# EAGLE design STM32F405RGT6  (EAGLE 9.6.2)
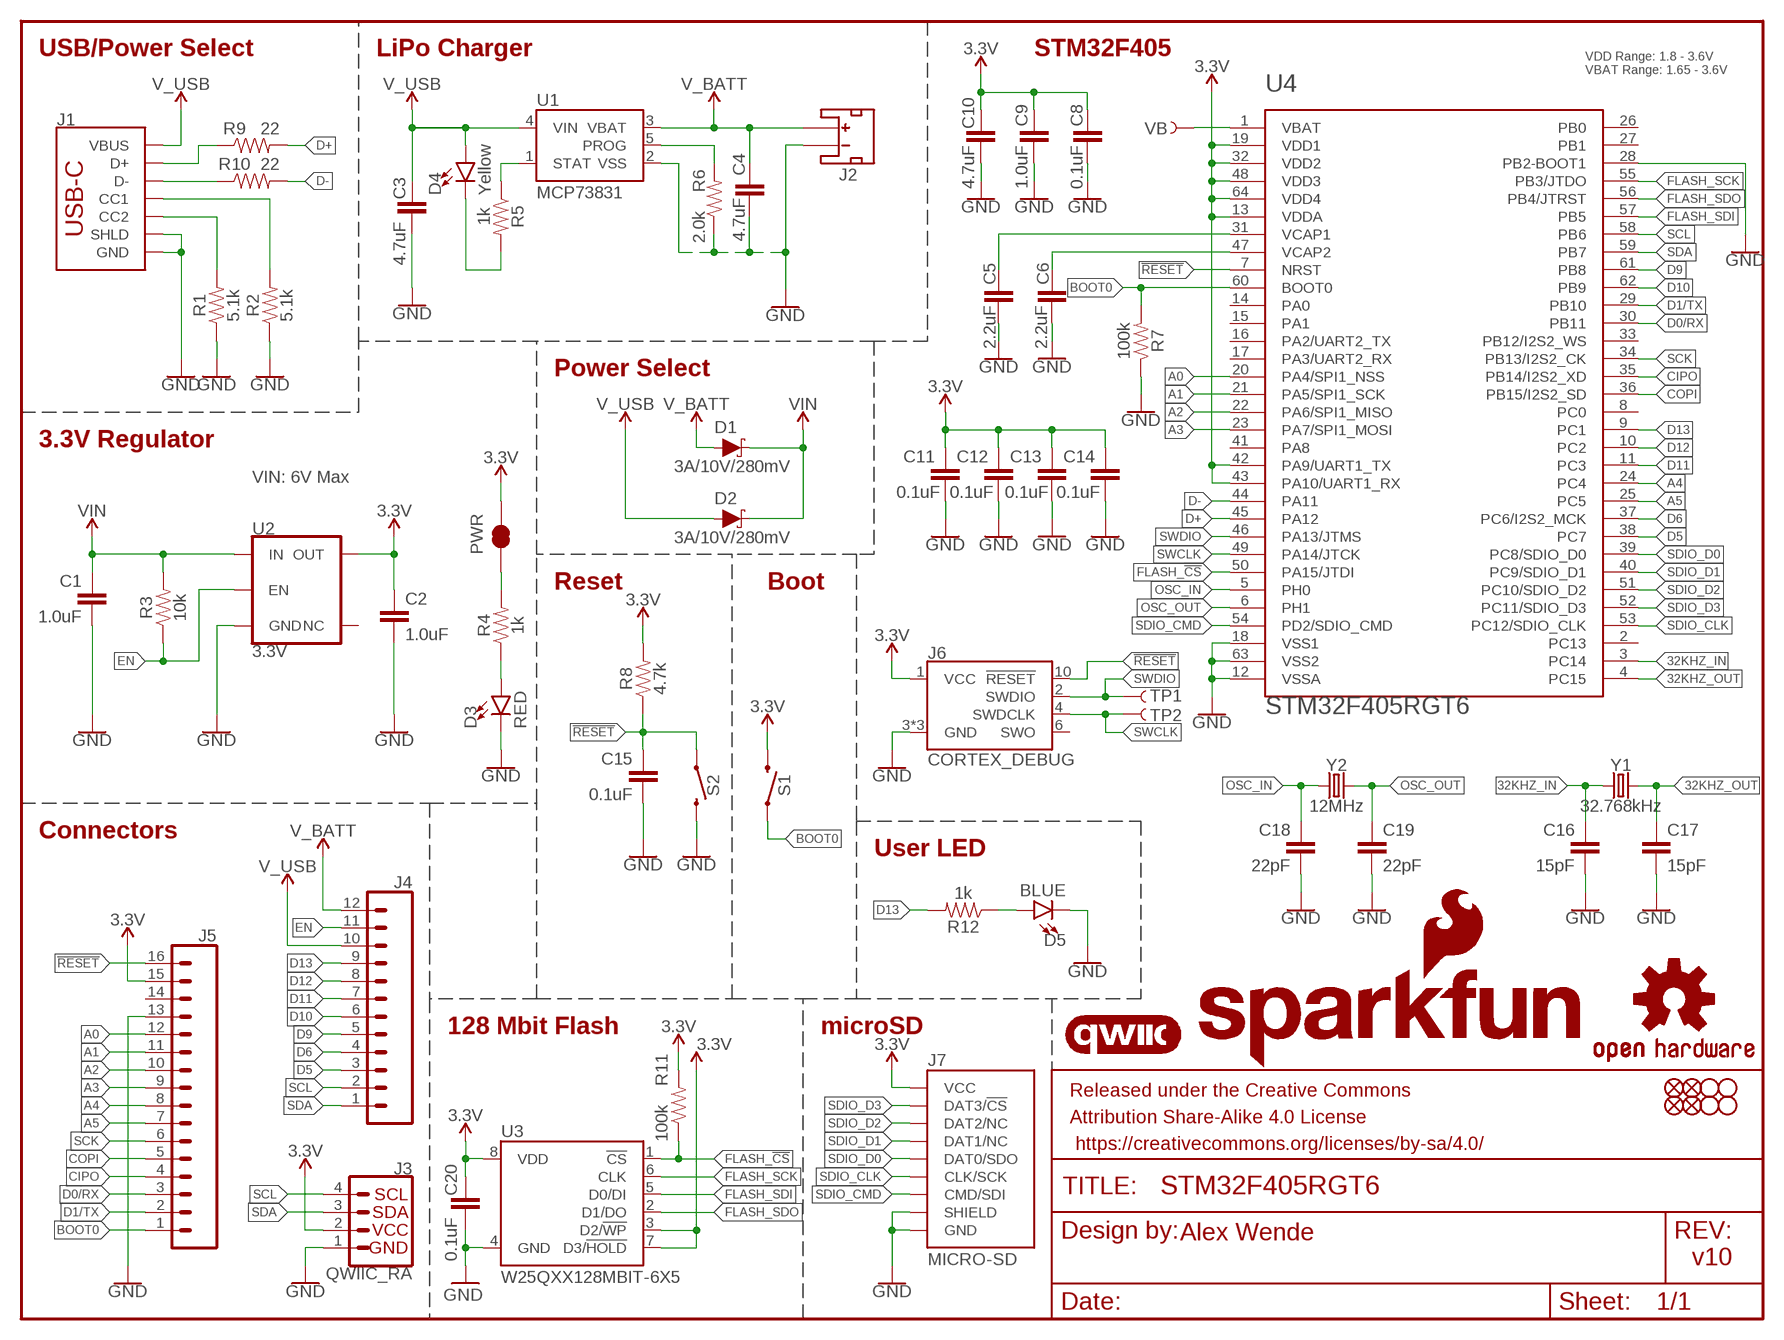
[diagram p0: schematic, sheet 1]

## Parts
C1  1.0uF  1.0UF-0402T-16V-10%  [0402-TIGHT]
C2  1.0uF  1.0UF-0402T-16V-10%  [0402-TIGHT]
C3  4.7uF  4.7UF-0402_TIGHT-6.3V-20%-X5R  [0402-TIGHT]
C4  4.7uF  4.7UF-0402_TIGHT-6.3V-20%-X5R  [0402-TIGHT]
C5  2.2uF  2.2UF-0402_TIGHT-10V-10%-X5R  [0402-TIGHT]
C6  2.2uF  2.2UF-0402_TIGHT-10V-10%-X5R  [0402-TIGHT]
C8  0.1uF  0.1UF-0402T-10V-10%-X7R  [0402-TIGHT]
C9  1.0uF  1.0UF-0402T-16V-10%  [0402-TIGHT]
C10  4.7uF  4.7UF-0402_TIGHT-6.3V-20%-X5R  [0402-TIGHT]
C11  0.1uF  0.1UF-0402T-10V-10%-X7R  [0402-TIGHT]
C12  0.1uF  0.1UF-0402T-10V-10%-X7R  [0402-TIGHT]
C13  0.1uF  0.1UF-0402T-10V-10%-X7R  [0402-TIGHT]
C14  0.1uF  0.1UF-0402T-10V-10%-X7R  [0402-TIGHT]
C15  0.1uF  0.1UF-0402T-10V-10%-X7R  [0402-TIGHT]
C16  15pF  15PF-0402T-50V-5%  [0402-TIGHT]
C17  15pF  15PF-0402T-50V-5%  [0402-TIGHT]
C18  22pF  22PF-0402T-16V-10%  [0402-TIGHT]
C19  22pF  22PF-0402T-16V-10%  [0402-TIGHT]
C20  0.1uF  0.1UF-0402T-10V-10%-X7R  [0402-TIGHT]
D1  3A/10V/280mV  DIODE-SCHOTTKY-BAT60A  [SOD-323]
D2  3A/10V/280mV  DIODE-SCHOTTKY-BAT60A  [SOD-323]
D3  RED  LED-RED0603  [LED-0603]
D4  Yellow  LED-YELLOW0603  [LED-0603]
D5  BLUE  LED-BLUE0603  [LED-0603]
FD1  FIDUCIALUFIDUCIAL  [FIDUCIAL-MICRO]
FD2  FIDUCIALUFIDUCIAL  [FIDUCIAL-MICRO]
FD3  FIDUCIALUFIDUCIAL  [FIDUCIAL-MICRO]
FD4  FIDUCIALUFIDUCIAL  [FIDUCIAL-MICRO]
FRAME1  FRAME-LETTER  [CREATIVE_COMMONS]
H1  STAND-OFFTIGHT  [STAND-OFF-TIGHT]
H2  STAND-OFFTIGHT  [STAND-OFF-TIGHT]
H3  STAND-OFFTIGHT  [STAND-OFF-TIGHT]
H4  STAND-OFFTIGHT  [STAND-OFF-TIGHT]
J1  USB_C_2-LAYER_PADS  [USB-C-16P-2LAYER-PADS]
J2  JST_2MM_MALE  [JST-2-SMD]
J3  QWIIC_RA  QWIIC_CONNECTORJS-1MM  [JST04_1MM_RA]
J4  CONN_12SM_SQ_NO_SILK  [1X12_SM_SQ_NOSILK]
J5  CONN_161X16_SM_SQ_NOSILK  [1X16_SM_SQ_NOSILK]
J6  CORTEX_DEBUG  CORTEX_JTAG_DEBUG_MINIMUM_PTH_NS  [2X5-PTH-1.27MM-NO_SILK]
J7  MICRO-SD  MICRO-SD-SDIOPUSH-PUSH  [MICRO-SD-SOCKET]
LOGO1  QWIIC_LOGO_5MM  [QWIIC_5MM]
LOGO2  SFE_LOGO_NAME_FLAME.1_INCH  [SFE_LOGO_NAME_FLAME_.1]
LOGO3  OSHW-LOGOS  [OSHW-LOGO-S]
PWR  JUMPER-SMT_2_NC_TRACE_NO-SILK  [SMT-JUMPER_2_NC_TRACE_NO-SILK]
R1  5.1k  5.1KOHM5.1KOHM-0603-1/10W-1%  [0603]
R2  5.1k  5.1KOHM5.1KOHM-0603-1/10W-1%  [0603]
R3  10k  10KOHM-0603-1/10W-1%  [0603]
R4  1k  1KOHM-0402T-1/16W-1%  [0402-TIGHT]
R5  1k  1KOHM-0402T-1/16W-1%  [0402-TIGHT]
R6  2.0k  2.0KOHM-0603-1/10W-5%  [0603]
R7  100k  100KOHM-0402T-1/16W-1%  [0402-TIGHT]
R8  4.7k  4.7KOHM-0603-1/10W-1%  [0603]
R9  22  22OHM-0603-1/10W-1%  [0603]
R10  22  22OHM-0603-1/10W-1%  [0603]
R11  100k  100KOHM-0402T-1/16W-1%  [0402-TIGHT]
R12  1k  1KOHM-0402T-1/16W-1%  [0402-TIGHT]
S1  MOMENTARY-SWITCH-SPST-SMD-4.6X2.8MM  [TACTILE_SWITCH_SMD_4.6X2.8MM]
S2  MOMENTARY-SWITCH-SPST-SMD-4.6X2.8MM  [TACTILE_SWITCH_SMD_4.6X2.8MM]
TP1  TEST-POINT3  [PAD.03X.03]
TP2  TEST-POINT3  [PAD.03X.03]
U1  MCP73831  [SOT23-5]
U2  3.3V  V_REG_AP2112K-3.3V  [SOT23-5]
U3  W25QXX128MBIT-6X5  [WSON-8-6X5]
U4  STM32F405RGT6  STM32F405RG  [TQFP64]
VB  TEST-POINT3  [PAD.03X.03]
Y1  32.768kHz  CRYSTAL-32.768KHZSMD-3.2X1.5  [CRYSTAL-SMD-3.2X1.5MM]
Y2  12MHz  CRYSTAL-12MHZ"  [CRYSTAL-SMD-5X3.2-4PAD]

## Nets
3.3V: C2.1 C8.1 C9.1 C10.1 C11.1 C12.1 C13.1 C14.1 C20.1 J3.2 J5.15 J6.1(VCC) J7.VCC PWR.2 R8.2 R11.2 S1.3 S1.4 U2.5(OUT) U3.3(D2/!WP!) U3.7(D3/!HOLD!) U3.8(VDD) U4.13(VDDA) U4.19(VDD1) U4.32(VDD2) U4.42(PA9/UART1_TX) U4.43(PA10/UART1_RX) U4.48(VDD3) U4.64(VDD4)
32KHZ_IN: C16.1 U4.3(PC14) Y1.P$1
32KHZ_OUT: C17.1 U4.4(PC15) Y1.P$2
!RESET: C15.1 J5.16 J6.10(!RESET) R8.1 S2.1 S2.2 U4.7(NRST)
A0: J5.12 U4.20(PA4/SPI1_NSS)
A1: J5.11 U4.21(PA5/SPI1_SCK)
A2: J5.10 U4.22(PA6/SPI1_MISO)
A3: J5.9 U4.23(PA7/SPI1_MOSI)
A4: J5.8 U4.24(PC4)
A5: J5.7 U4.25(PC5)
BOOT0: J5.1 R7.2 S1.1 S1.2 U4.60(BOOT0)
CIPO: J5.4 U4.35(PB14/I2S2_XD)
COPI: J5.5 U4.36(PB15/I2S2_SD)
D0/RX: J5.3 U4.30(PB11)
D1/TX: J5.2 U4.29(PB10)
D5: J4.3 U4.38(PC7)
D6: J4.4 U4.37(PC6/I2S2_MCK)
D9: J4.5 U4.61(PB8)
D10: J4.6 U4.62(PB9)
D11: J4.7 U4.11(PC3)
D12: J4.8 U4.10(PC2)
D13: J4.9 R12.2 U4.9(PC1)
D+: R9.2 U4.45(PA12)
D-: R10.2 U4.44(PA11)
EN: J4.11 R3.1 U2.3(EN)
FLASH_!CS: R11.1 U3.1(!CS!) U4.50(PA15/JTDI)
FLASH_SCK: U3.6(CLK) U4.55(PB3/JTDO)
FLASH_SDI: U3.5(D0/DI) U4.57(PB5)
FLASH_SDO: U3.2(D1/DO) U4.56(PB4/JTRST)
GND: C1.2 C2.2 C3.2 C4.2 C5.2 C6.2 C8.2 C9.2 C10.2 C11.2 C12.2 C13.2 C14.2 C15.2 C16.2 C17.2 C18.2 C19.2 C20.2 D3.C D5.C J1.GND J1.GND2(GND) J1.SHLD1(SHLD) J1.SHLD2(SHLD) J1.SHLD3(SHLD) J1.SHLD4(SHLD) J2.1(-) J3.1 J5.13 J6.3(GND) J6.5(GND) J6.9(GND) J7.CD1(SHIELD) J7.GND J7.GND1(GND) J7.GND3(GND) R1.1 R2.1 R6.1 R7.1 S2.3 S2.4 U1.2(VSS) U2.2(GND) U3.4(GND) U4.12(VSSA) U4.18(VSS1) U4.28(PB2-BOOT1) U4.63(VSS2)
N$1: D5.A R12.1
N$2: PWR.1 R4.2
N$3: J1.A6(D+) J1.B6(D+) R9.1
N$6: J1.A7(D-) J1.B7(D-) R10.1
N$7: D3.A R4.1
N$8: R6.2 U1.5(PROG)
N$9: J1.A5(CC1) R2.2
N$10: J1.B5(CC2) R1.2
N$14: D4.C R5.2
N$15: R5.1 U1.1(STAT)
N$16: C5.1 U4.31(VCAP1)
N$18: C6.1 U4.47(VCAP2)
OSC_IN: C18.1 U4.5(PH0) Y2.1
OSC_OUT: C19.1 U4.6(PH1) Y2.3
SCK: J5.6 U4.34(PB13/I2S2_CK)
SCL: J3.4 J4.2 U4.58(PB6)
SDA: J3.3 J4.1 U4.59(PB7)
SDIO_CLK: J7.SCLK(CLK/SCK) U4.53(PC12/SDIO_CLK)
SDIO_CMD: J7.DI/CMD(CMD/SDI) U4.54(PD2/SDIO_CMD)
SDIO_D0: J7.DO/DAT0(DAT0/SDO) U4.39(PC8/SDIO_D0)
SDIO_D1: J7.DAT1(DAT1/NC) U4.40(PC9/SDIO_D1)
SDIO_D2: J7.DAT2(DAT2/NC) U4.51(PC10/SDIO_D2)
SDIO_D3: J7.CS/DAT3(DAT3/!CS!) U4.52(PC11/SDIO_D3)
SWCLK: J6.4(SWDCLK) TP2.P$1 U4.49(PA14/JTCK)
SWDIO: J6.2(SWDIO) TP1.P$1 U4.46(PA13/JTMS)
V_BATT: C4.1 D1.A J2.2(+) J4.12 U1.3(VBAT)
V_USB: C3.1 D2.A D4.A J1.VBUS1(VBUS) J1.VBUS2(VBUS) J4.10 U1.4(VIN)
VB: U4.1(VBAT) VB.P$1
VIN: C1.1 D1.C D2.C R3.2 U2.1(IN)
Unconnected: J2.NC1(PAD1) J2.NC2(PAD2) J5.14 J6.6(SWO) U2.4(NC) U4.2(PC13) U4.8(PC0) U4.14(PA0) U4.15(PA1) U4.16(PA2/UART2_TX) U4.17(PA3/UART2_RX) U4.26(PB0) U4.27(PB1) U4.33(PB12/I2S2_WS) U4.41(PA8)

## Notes on the sheet
- USB/Power Select | LiPo Charger | STM32F405
- VDD Range: 1.8 - 3.6V
  VBAT Range: 1.65 - 3.6V
- Power Select
- 3.3V Regulator
- VIN: 6V Max
- Reset | Boot
- Connectors
- User LED
- 128 Mbit Flash | microSD
- Alex Wende
- v10

## Library data of the parts
C1 C2 C9 = SparkFun-Capacitors:1.0UF: 1µF ceramic capacitors A capacitor is a passive two-terminal electrical component used to store electrical energy temporarily in an electric field.; PROD_ID: CAP-12417
C3 C4 C10 = SparkFun-Capacitors:4.7UF: 4.7µF ceramic capacitors A capacitor is a passive two-terminal electrical component used to store electrical energy temporarily in an electric field.; PROD_ID: CAP-14240
C5 C6 = SparkFun-Capacitors:2.2UF: 2.2µF ceramic capacitors A capacitor is a passive two-terminal electrical component used to store electrical energy temporarily in an electric field.; PROD_ID: CAP-14232
C8 C11-C15 C20 = SparkFun-Capacitors:0.1UF: 0.1µF ceramic capacitors A capacitor is a passive two-terminal electrical component used to store electrical energy temporarily in an electric field.; PROD_ID: CAP-15083
C16 C17 = SparkFun-Capacitors:15PF: 15pF ceramic capacitors A capacitor is a passive two-terminal electrical component used to store electrical energy temporarily in an electric field.; PROD_ID: CAP-13063
C18 C19 = SparkFun-Capacitors:22PF: 22pF ceramic capacitors A capacitor is a passive two-terminal electrical component used to store electrical energy temporarily in an electric field.; PROD_ID: CAP-14674
D1 D2 = SparkFun-DiscreteSemi:DIODE-SCHOTTKY: Schottky diode A Schottky diode is a semiconductor diode which has a low forward voltage drop and a very fast switching action.; PROD_ID: DIO-14072
D3 = SparkFun-LED:LED-RED: Red SMD LED Used in manufacturing of most products at SparkFun Packages: 0603 - SMD 0603 package [Product Link] <http://docs.avagotech.com/docs/AV02-0551EN> 0603 SMART - SMD 0603 SMART package ( more efficient and expensive)[Product Link] <http://www.osram-os.com/Graphics/XPic2/00077099_0.pdf> 1206 - SMD1206 package [Product Link] <https://www.sparkfun.com/datasheets/DevTools/LilyPad/Q150OVS4.pdff> SparkFun Products: Pro Mini 328 -5V <https://www.sparkfun.com/products/821> RedBoard <https://www.sparkfun.com/products/12757> IOIO-OTG <https://www.sparkfun.com/products/13613>; PROD_ID: DIO-00819
D4 = SparkFun-LED:LED-YELLOW: Yellow SMD LED Used in manufacturing several products at SparkFun. Packages: 0603 - SMD 0603 package[Product Link] <http://www.kingbrightusa.com/product.asp?catalog_name=LED&product_id=APT1608SYCK> 0603 -SMART - SMART SMD 0603 package (more efficient/more expensive) [Product Link] <http://www.osram-os.com/osram_os/en/products/product-catalog/led-light-emitting-diodes/smartled-0603/ly-l29k/index.jsp> LilyPad - SMD1206 package[Product Datasheet] <https://www.sparkfun.com/datasheets/DevTools/LilyPad/Q150YUS4.pdf> SparkFun Products: Blynk Board <https://www.sparkfun.com/products/13794> IOIO-OTG <https://www.sparkfun.com/products/13613> XBee Explorer Serial <https://www.sparkfun.com/products/13225>; PROD_ID: DIO-09003
D5 = SparkFun-LED:LED-BLUE: Blue SMD LED Used in manufacturing of various products at SparkFun Packages: 0603 - SMD 0603 package [Product Link] <http://www.digikey.com/product-detail/en/SMLE12BC7TT86/511-1589-2-ND/1641808> 1206 - SMD1206 package [Product Link] <http://www.digikey.com/product-detail/en/lite-on-inc/LTST-C150TBKT/160-1643-1-ND/573584> SparkFun Products: ESP8266 Thing-Dev Board <https://www.sparkfun.com/products/13711> RedBoard <https://www.sparkfun.com/products/12757>; PROD_ID: DIO-08575
FD1-FD4 = SparkFun-Aesthetics:FIDUCIAL: Fiducial Alignment Points Point-of-reference for pick-and-place machines and other optical instruments.
FRAME1 = SparkFun-Aesthetics:FRAME-LETTER: Schematic Frame - Letter Standard 8.5x11 US Letter frame
H1-H4 = SparkFun-Hardware:STAND-OFF: Stand Off Drill holes for mechanically mounting via screws, standoffs, etc. Note: Use the keepout ring to avoid running the screw head into surrounding components. Variant Overviews STAND-OFF - Mechanical footprint for a #4 phillips button head screw. STAND-OFF-TIGHT - Mechanical footprint for a #4 phillips button head screw, Example SparkFun Products Screw - Phillips Head (1/4", 4-40, 10 pack) <https://www.sparkfun.com/products/10453> (PRT-10453) Screw - Phillips Head (1/2", 4-40, 10 pack) <https://www.sparkfun.com/products/10452> (PRT-10452) Screw - Phillips Head (3/4", 4-40, 10 pack) <https://www.sparkfun.com/products/10451> (PRT-10451) Screw - Phillips Head (1", 4-40, 10 pack) <https://www.sparkfun.com/products/10450> (PRT-10450)
J1 = SparkFun-Connectors:USB_C: USB Type C 16Pin Connector Super Speed pins not available on the 16-pin purely SMD connector so this part is best for USB 2.0 implementations. D1 and D2 are tied together enabling D+/- no matter which way the cable is plugged into the connector. The two channel configuration pins (CC1/2) are exposed. These are normally connected to ground via 5.1k resistors but can be reconfigured for high current/high power applications.; PROD_ID: CONN-14122
J2 = SparkFun-Connectors:JST_2MM_MALE: JST 2MM MALE RA CONNECTOR Two pin, compact surface mount connector. Commonly used as a battery input connection point. We really like the solid locking feeling and high current rating on these small connectors. We use these all the time as battery connectors. Mates to single-cell LiPo batteries. Here is the connector we sell at SparkFun: JST Right Angle Connector - White <https://www.sparkfun.com/products/8612> (PRT-08612) Datasheet <http://www.sparkfun.com/datasheets/Prototyping/Connectors/JST-Horizontal.pdf> It was used on these SparkFun products: SparkFun MOSFET Power Controller <https://www.sparkfun.com/products/11214> (PRT-11214) SparkFun Battery Babysitter - LiPo Battery Manager <https://www.sparkfun.com/products/13777> (PRT-13777) And many, many others that required a lipo battery connection.; PROD_ID: CONN-11443; SF_ID: PRT-08612
J3 = SparkFun-Connectors:QWIIC_CONNECTOR: SparkFun I2C Standard Qwiic Connector An SMD 1mm pitch JST connector makes it easy and quick (get it? Qwiic?) to connect I2C devices to each other. The Qwiic system <http://www.sparkfun.com/qwiic> enables fast and solderless connection between popular platforms and various sensors and actuators. We carry 200mm <https://www.sparkfun.com/products/14204>, 100mm <https://www.sparkfun.com/products/14205>, 50mm <https://www.sparkfun.com/products/14206>, and breadboard friendly <https://www.sparkfun.com/products/14207> Qwiic cables. We also offer 10 pcs strips <https://www.sparkfun.com/products/14323> the SMD connectors.; PROD_ID: CONN-13694; VALUE: QWIIC_RIGHT_ANGLE
J4 = SparkFun-Connectors:CONN_12: Multi connection point. Often used as Generic Header-pin footprint for 0.1 inch spaced/style header connections On any of the 0.1 inch spaced packages, you can populate with these: Break Away Headers - Straight <https://www.sparkfun.com/products/116> (PRT-00116) Break Away Male Headers - Right Angle <https://www.sparkfun.com/products/553> (PRT-00553) Female Headers <https://www.sparkfun.com/products/115> (PRT-00115) Break Away Headers - Machine Pin <https://www.sparkfun.com/products/117> (PRT-00117) Break Away Female Headers - Swiss Machine Pin <https://www.sparkfun.com/products/743> (PRT-00743) For SCREWTERMINALS and SPRING TERMINALS visit here: Screw Terimnals on SparkFun.com <https://www.sparkfun.com/search/results?term=Screw+Terminals> (5mm/3.5mm/2.54mm spacing) This device is also useful as a general connection point to wire up your design to another part of your project. Our various solder wires solder well into these plated through hole pads. Hook-Up Wire - Assortment (Stranded, 22 AWG) <https://www.sparkfun.com/products/11375> (PRT-11375) Hook-Up Wire - Assortment (Solid Core, 22 AWG) <https://www.sparkfun.com/products/11367> (PRT-11367) View the entire wire category on our website here <https://www.sparkfun.com/categories/141> Special notes: Molex polarized connector foot print use with SKU : PRT-08231 with associated crimp pins and housings. 1MM SMD Version SKU: PRT-10208 NOTES ON THE VARIANTS LOCK and LOCK_LONGPADS... This footprint was designed to help hold the alignment of a through-hole component (i.e. 6-pin header) while soldering it into place. You may notice that each hole has been shifted either up or down by 0.005 of an inch from it's more standard position (which is a perfectly straight line). This slight alteration caused the pins (the squares in the middle) to touch the edges of the holes. Because they are alternating, it causes a "brace" to hold the component in place. 0.005 has proven to be the perfect amount of "off-center" position when using our standard breakaway headers. Although looks a little odd when you look at the bare footprint, once you have a header in there, the alteration is very hard to notice. Also,if you push a header all the way into place, it is covered up entirely on the bottom side.
J5 = SparkFun-Connectors:CONN_16: Multi connection point. Often used as Generic Header-pin footprint for 0.1 inch spaced/style header connections On any of the 0.1 inch spaced packages, you can populate with these: Break Away Headers - Straight <https://www.sparkfun.com/products/116> (PRT-00116) Break Away Male Headers - Right Angle <https://www.sparkfun.com/products/553> (PRT-00553) Female Headers <https://www.sparkfun.com/products/115> (PRT-00115) Break Away Headers - Machine Pin <https://www.sparkfun.com/products/117> (PRT-00117) Break Away Female Headers - Swiss Machine Pin <https://www.sparkfun.com/products/743> (PRT-00743) For SCREWTERMINALS and SPRING TERMINALS visit here: Screw Terimnals on SparkFun.com <https://www.sparkfun.com/search/results?term=Screw+Terminals> (5mm/3.5mm/2.54mm spacing) This device is also useful as a general connection point to wire up your design to another part of your project. Our various solder wires solder well into these plated through hole pads. Hook-Up Wire - Assortment (Stranded, 22 AWG) <https://www.sparkfun.com/products/11375> (PRT-11375) Hook-Up Wire - Assortment (Solid Core, 22 AWG) <https://www.sparkfun.com/products/11367> (PRT-11367) View the entire wire category on our website here <https://www.sparkfun.com/categories/141> Special notes: Molex polarized connector foot print use with SKU : PRT-08231 with associated crimp pins and housings. 1MM SMD Version SKU: PRT-10208 NOTES ON THE VARIANTS LOCK and LOCK_LONGPADS... This footprint was designed to help hold the alignment of a through-hole component (i.e. 6-pin header) while soldering it into place. You may notice that each hole has been shifted either up or down by 0.005 of an inch from it's more standard position (which is a perfectly straight line). This slight alteration caused the pins (the squares in the middle) to touch the edges of the holes. Because they are alternating, it causes a "brace" to hold the component in place. 0.005 has proven to be the perfect amount of "off-center" position when using our standard breakaway headers. Although looks a little odd when you look at the bare footprint, once you have a header in there, the alteration is very hard to notice. Also,if you push a header all the way into place, it is covered up entirely on the bottom side.
J6 = SparkFun-Connectors:CORTEX_JTAG_DEBUG_MINIMUM: Cortex Debug Connector - 10 pin Supports JTAG debug, Serial Wire debug, and Serial Wire Viewer. PTH and SMD connector options available. General Connector Information <http://infocenter.arm.com/help/topic/com.arm.doc.faqs/attached/13634/cortex_debug_connectors.pdf> Products: PTH Connector <http://www.digikey.com/product-detail/en/cnc-tech/3220-10-0100-00/1175-1627-ND/3883661> -via Digi-Key SparkFun PSoc <https://www.sparkfun.com/products/13229> SparkFun T <https://www.sparkfun.com/products/13810>
J7 = SparkFun-Connectors:MICRO-SD-SDIO: microSD Socket for Transflash Push-push type µSD socket. tDoc lines correctly indicate media card edge positions when inserting (unlocked, locked, depressed). NOTE: CD1 and CD2 are connected internally, and the default detect state of the socket is detect pin to ground. SparkFun Products: WAV Trigger <https://www.sparkfun.com/products/13660> CAN-Bus Shield <https://www.sparkfun.com/products/13262> SparkFun Level Shifing microSD Breakout <https://www.sparkfun.com/products/13743>; PROD_ID: CONN-07820
LOGO1 = SparkFun-Aesthetics:QWIIC_LOGO: Qwiic Logos for placement on schematic and PCB. The 5.5mm silk logo is best for placing next to Qwiic connector.
LOGO2 = SparkFun-Aesthetics:SFE_LOGO_NAME_FLAME: SparkFun Font Logo w/ Flame This is the SparkFun full logo. The logo on the schematic will always be the same size; the package variant is the height of the flame part of the logo. Default layer for the logo on the board is tSilk.
LOGO3 = SparkFun-Aesthetics:OSHW-LOGO: Open-Source Hardware (OSHW) Logo This logo indicates the piece of hardware it is found on incorporates a OSHW license and/or adheres to the definition of open source hardware found here: http://freedomdefined.org/OSHW
PWR = SparkFun-Jumpers:JUMPER-SMT_2_NC_TRACE: Normally closed trace jumper This jumper has a trace between two pads so it's normally closed (NC). Use a razor knife to open the connection. For best results follow the IPC guidelines for cutting traces: Cutout at least 0.063 mm (0.005 in). Remove all loose material to clean up the cut area. Seal the cut with an approved epoxy. Reapply solder to reclose the connection.
R1 R2 = SparkFun-Resistors:5.1KOHM; PROD_ID: RES-12083
R3 = SparkFun-Resistors:10KOHM: 10kΩ resistor A resistor is a passive two-terminal electrical component that implements electrical resistance as a circuit element. Resistors act to reduce current flow, and, at the same time, act to lower voltage levels within circuits. - Wikipedia; PROD_ID: RES-00824
R4 R5 R12 = SparkFun-Resistors:1KOHM: 1kΩ resistor A resistor is a passive two-terminal electrical component that implements electrical resistance as a circuit element. Resistors act to reduce current flow, and, at the same time, act to lower voltage levels within circuits. - Wikipedia; PROD_ID: RES-14342
R6 = SparkFun-Resistors:2.0KOHM: 2kΩ resistor A resistor is a passive two-terminal electrical component that implements electrical resistance as a circuit element. Resistors act to reduce current flow, and, at the same time, act to lower voltage levels within circuits. - Wikipedia; PROD_ID: RES-08296
R7 R11 = SparkFun-Resistors:100KOHM: 100kΩ resistor A resistor is a passive two-terminal electrical component that implements electrical resistance as a circuit element. Resistors act to reduce current flow, and, at the same time, act to lower voltage levels within circuits. - Wikipedia; PROD_ID: RES-13495
R8 = SparkFun-Resistors:4.7KOHM: 4.7kΩ resistor A resistor is a passive two-terminal electrical component that implements electrical resistance as a circuit element. Resistors act to reduce current flow, and, at the same time, act to lower voltage levels within circuits. - Wikipedia; PROD_ID: RES-07857
R9 R10 = SparkFun-Resistors:22OHM: 22Ω resistor A resistor is a passive two-terminal electrical component that implements electrical resistance as a circuit element. Resistors act to reduce current flow, and, at the same time, act to lower voltage levels within circuits. - Wikipedia; PROD_ID: RES-08698
S1 S2 = SparkFun-Switches:MOMENTARY-SWITCH-SPST: Momentary Switch (Pushbutton) - SPST Normally-open (NO) SPST momentary switches (buttons, pushbuttons). Variants PTH-12MM - 12mm square, through-hole Momentary Pushbutton Switch - 12mm Square <https://www.sparkfun.com/products/9190> (COM-09190) PTH-6.0MM, PTH-6.0MM-KIT - 6.0mm square, through-hole Mini Pushbutton Switch <https://www.sparkfun.com/products/97> (COM-00097) KIT package intended for soldering kit's - only one side of pads' copper is exposed. PTH-RIGHT-ANGLE-KIT - Right-angle, through-hole Right Angle Tactile Button <https://www.sparkfun.com/products/10791> - Used on SparkFun BigTime Watch Kit <https://www.sparkfun.com/products/11734> SMD-12MM - 12mm square, surface-mount Tactile Button - SMD (12mm) <https://www.sparkfun.com/products/12993> (COM-12993) Used on SparkFun PicoBoard <https://www.sparkfun.com/products/11888> SMD-4.5MM - 4.5mm Square Trackball Switch Used on SparkFun Blackberry Trackballer Breakout <https://www.sparkfun.com/products/13169> SMD-4.6MMX2.8MM - 4.60mm x 2.80mm, surface mount Used on SparkFun SAMD21 Mini Breakout <https://www.sparkfun.com/products/13664> SMD-5.2MM, SMD-5.2-REDUNDANT - 5.2mm square, surface-mount Mini Pushbutton Switch - SMD <https://www.sparkfun.com/products/8720> (COM-08720) Used on Arduino Pro Mini <https://www.sparkfun.com/products/11114> REDUNDANT package connects both switch circuits together SMD-6.0X3.5MM - 6.0 x 3.5mm, surface mount Momentary Reset Switch SMD <https://www.sparkfun.com/products/8229> (COM-08229) SMD-6.2MM-TALL - 6.2mm square, surface mount Tactile Button - SMD (6mm) <https://www.sparkfun.com/products/12992> Used on SparkFun Digital Sandbox <https://www.sparkfun.com/products/12651> SMD-RIGHT-ANGLE - Right-angle, surface mount Used on SparkFun Block for Intel® Edison - Arduino <https://www.sparkfun.com/products/13036>; PROD_ID: SWCH-13065
TP1 TP2 VB = SparkFun-Connectors:TEST-POINT: SparkFun Test Points Bare copper test points for troubleshooting or In-Circuit-Testing. These are used by our Production team for verifying production board runs using pogo-pins on test beds. SparkFun Products: SparkFun LSM9DS1 Breakout <https://www.sparkfun.com/products/13284> SparkFun PSOC <https://www.sparkfun.com/products/13714> SparkFun Load Cell Amplifier <https://www.sparkfun.com/products/13879>
U1 = SparkFun-IC-Power:MCP73831: MCP73831T Li-Ion, Li-Pol Controller Miniature single cell, fully integrated Li-Ion, Li-polymer charge management controller Datasheet <http://ww1.microchip.com/downloads/en/DeviceDoc/20001984g.pdf> SparkFun Products: SparkFun ESP32 Thing <https://www.sparkfun.com/products/13907> SparkFun 9DoF Razor IMU M0 <https://www.sparkfun.com/products/14001>; PROD_ID: IC-09995
U2 = SparkFun-IC-Power:V_REG_AP2112: AP2112 - 600mA CMOS LDO Regulator w/ Enable The AP2112 is CMOS process low dropout linear regulator with enable function, the regulator delivers a guaranteed 600mA (min.) continuous load current. Features Output Voltage Accuracy: ±1.5% Output Current: 600mA (Min.) Foldback Short Current Protection: 50mA Enable Function to Turn ON/OFF VOUT Low Dropout Voltage (3.3V): 250mV (Typ.) @IOUT=600mA Excellent Load Regulation: 0.2%/A (Typ.) Excellent Line Regulation: 0.02%/V (Typ.) Low Quiescent Current: 55μA (Typ.) Low Standby Current: 0.01μA (Typ.) Low Output Noise: 50μVRMS PSRR: 100Hz -65dB, 1kHz -65dB OTSD Protection Stable with 1.0μF Flexible Cap: Ceramic, Tantalum and Aluminum Electrolytic Operation Temperature Range: -40°C to 85°C ESD: MM 400V, HBM 4000V; PROD_ID: VREG-12457
U3 = SparkFun-MicroMod:W25QXX; PROD_ID: IC-15107
U4 = STM32_Temp:STM32F405RG: STM32F405RGT6 ARM DSP Chip used on the WAV Trigger board. IC MCU 32BIT 1MB FLASH 64LQFP Datasheet <https://cdn.sparkfun.com/datasheets/Widgets/STM32F405RGT6.pdf> SparkFun Products WAV Trigger <https://www.sparkfun.com/products/13660> (WIG-13660); PROD_ID: IC-11709
Y1 = SparkFun-Clocks:CRYSTAL-32.768KHZ: 32.768kHz Crystal Frequency: 32.768kHz Frequency Stability: ±20ppm Load Capacitance: 12.5pF (PTH-2X6 & SMD-3.2X1.5), 6pF (SMD-2X6) SparkFun Products: SparkFun BigTime Watch Kit <https://www.sparkfun.com/products/11734> SparkFun nRF52832 Breakout <https://www.sparkfun.com/products/13990> SparkFun Real Time Clock Module <https://www.sparkfun.com/products/12708>; PROD_ID: XTAL-13062
Y2 = SparkFun-Clocks:CRYSTAL-12MHZ: 12.0MHz Crystal Frequency: 12.0MHz Frequency Tolerance: ±20ppm Load Capacitance: 18pF SparkFun Products: SparkFun Logomatic <https://www.sparkfun.com/products/12772> Pocket AVR Programmer <https://www.sparkfun.com/products/9825>; PROD_ID: XTAL-08297

## Net classes
1 power: width 0.762 mm

## Board
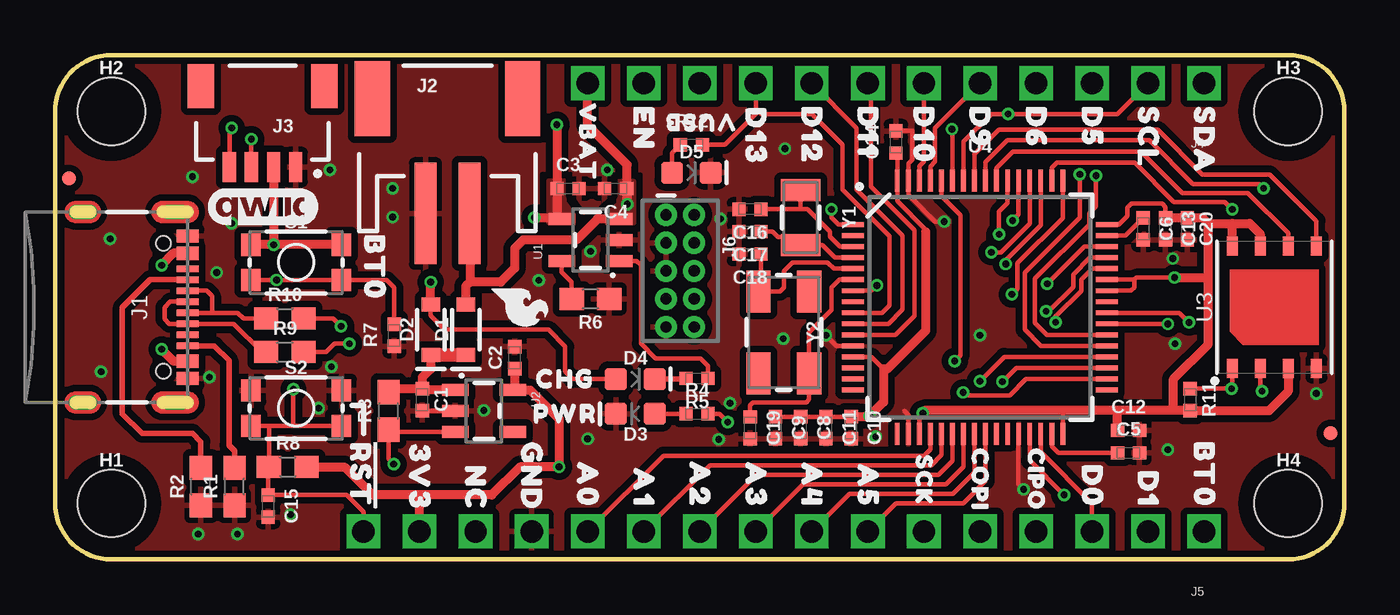
[diagram p1: board, top side]
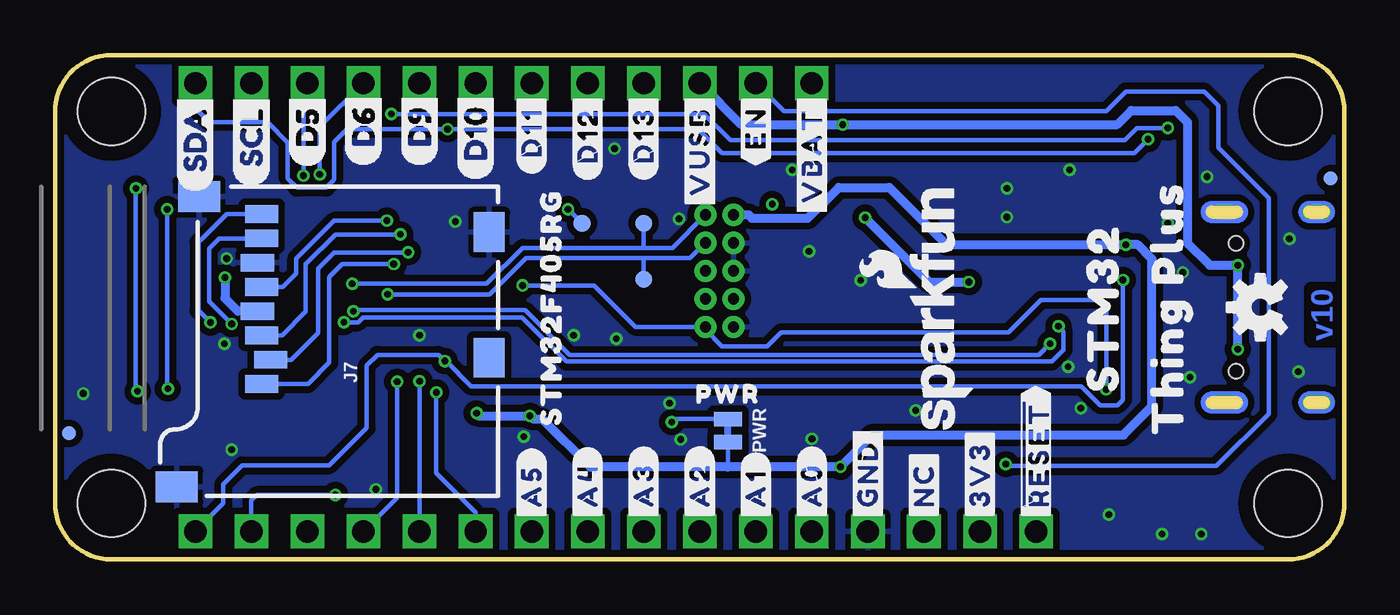
[diagram p2: board, bottom side, seen from below]

Size 58.42 x 22.86 mm. Coordinates in mm from the lower left corner, seen from the top.
Outline: 2.54,0 55.88,0 arc90 58.42,2.54 58.42,20.32 arc90 55.88,22.86 2.54,22.86 arc90 0,20.32 0,2.54 arc90 2.54,0
Copper layers (1*16): Top 0.035mm / dielectric 1.5mm / Bottom 0.035mm
Design rules "SparkFun-2-layer-FAB-LIMIT": minimum track width 4mil, minimum drill 6mil, track to track 4mil, track to pad 4mil, pad to pad 4mil, via to via 4mil, smd to smd 4mil, copper to edge 4mil, drill to drill 4mil, minimum pad ring 5mil, minimum via ring 5mil, stop-mask expansion 4mil, vias tented up to drill 25mil, thermal gap 10mil

### Footprints (pad centres in the part's own frame; a part is rotated, then mirrored left to right if it is on the bottom)
0402-TIGHT = smd 0.6 x 0.6: 1 -0.5,0; 2 0.5,0
SOD-323 = smd 0.63 x 0.83: A 1.15,0; C -1.15,0
LED-0603 = smd 1 x 1: A -0.877,0; C 0.877,0
FIDUCIAL-MICRO = smd 0.635 x 0.635: 1 0,0
STAND-OFF-TIGHT = hole 3.048: 0,0
USB-C-16P-2LAYER-PADS = smd 0.3 x 1: A5 -1.25,-0.34; A6 -0.25,-0.34; A7 0.25,-0.34; A8 1.25,-0.34; B5 1.75,-0.34; B6 0.75,-0.34; B7 -0.75,-0.34; B8 -1.75,-0.34 | smd 0.6 x 1: GND -3.225,-0.34; GND2 3.225,-0.34; VBUS1 -2.45,-0.34; VBUS2 2.45,-0.34 | drill 0.4 pad 0.6 long: SHLD1 -4.318,-0.915; SHLD2 4.318,-0.915; SHLD3 -4.318,-5.095; SHLD4 4.318,-5.095 | hole 0.65: -2.89,-1.445; 2.89,-1.445
JST-2-SMD = smd 1 x 4.6: 1 -1,-3.7; 2 1,-3.7 | smd 1.6 x 3.4: NC1 -3.4,1.5; NC2 3.4,1.5
JST04_1MM_RA = smd 0.6 x 1.35: 1 -1.5,0; 2 -0.5,0; 3 0.5,0; 4 1.5,0 | smd 1.2 x 2: NC1 2.8,-3.675; NC2 -2.8,-3.675
1X12_SM_SQ_NOSILK = drill 1.016 pad 1.27 square: 1 0,0; 2 2.54,0; 3 5.08,0; 4 7.62,0; 5 10.16,0; 6 12.7,0; 7 15.24,0; 8 17.78,0; 9 20.32,0; 10 22.86,0; 11 25.4,0; 12 27.94,0
1X16_SM_SQ_NOSILK = drill 1.016 pad 1.27 square: 1 0,0; 2 2.54,0; 3 5.08,0; 4 7.62,0; 5 10.16,0; 6 12.7,0; 7 15.24,0; 8 17.78,0; 9 20.32,0; 10 22.86,0; 11 25.4,0; 12 27.94,0; 13 30.48,0; 14 33.02,0; 15 35.56,0; 16 38.1,0
2X5-PTH-1.27MM-NO_SILK = drill 0.508 pad 1: 1 -2.54,-0.635; 2 -2.54,0.635; 3 -1.27,-0.635; 4 -1.27,0.635; 5 0,-0.635; 6 0,0.635; 7 1.27,-0.635; 8 1.27,0.635; 9 2.54,-0.635; 10 2.54,0.635
MICRO-SD-SOCKET = smd 1.8 x 1.4: CD1 -2.05,0.4; CD2 -7.75,0.4 | smd 0.8 x 1.5: CS/DAT3 -7.84,10.3; DAT1 -1.24,10.7; DAT2 -8.94,10.7; DI/CMD -6.74,10.7; DO/DAT0 -2.34,10.7; GND -3.44,10.9; SCLK -4.54,10.7; VCC -5.64,10.9 | smd 1.4 x 1.9: GND1 -13.6,14.55; GND3 -0.45,13.55
SMT-JUMPER_2_NC_TRACE_NO-SILK = smd 0.66 x 1.27: 1 -0.521,0; 2 0.521,0
0603 = smd 1.1 x 1: 1 -0.85,0; 2 0.85,0
TACTILE_SWITCH_SMD_4.6X2.8MM = smd 0.9 x 1: 1 -2.05,-0.8; 2 2.05,-0.8; 3 2.05,0.8; 4 -2.05,0.8
PAD.03X.03 = smd 0.762 x 0.762: P$1 0,0
SOT23-5 = smd 0.55 x 1.2: 1 -0.95,-1.3; 2 0,-1.3; 3 0.95,-1.3; 4 0.95,1.3; 5 -0.95,1.3
WSON-8-6X5 = smd 0.85 x 0.5: 1 -2.775,1.905; 2 -2.775,0.635; 3 -2.775,-0.635; 4 -2.775,-1.905; 5 2.775,-1.905; 6 2.775,-0.635; 7 2.775,0.635; 8 2.775,1.905
TQFP64 = smd 0.22 x 1: 1 -3.75,-5.75; 2 -3.25,-5.75; 3 -2.75,-5.75; 4 -2.25,-5.75; 5 -1.75,-5.75; 6 -1.25,-5.75; 7 -0.75,-5.75; 8 -0.25,-5.75; 9 0.25,-5.75; 10 0.75,-5.75; 11 1.25,-5.75; 12 1.75,-5.75; 13 2.25,-5.75; 14 2.75,-5.75; 15 3.25,-5.75; 16 3.75,-5.75; 33 3.75,5.75; 34 3.25,5.75; 35 2.75,5.75; 36 2.25,5.75; 37 1.75,5.75; 38 1.25,5.75; 39 0.75,5.75; 40 0.25,5.75; 41 -0.25,5.75; 42 -0.75,5.75; 43 -1.25,5.75; 44 -1.75,5.75; 45 -2.25,5.75; 46 -2.75,5.75; 47 -3.25,5.75; 48 -3.75,5.75 | smd 1 x 0.22: 17 5.75,-3.75; 18 5.75,-3.25; 19 5.75,-2.75; 20 5.75,-2.25; 21 5.75,-1.75; 22 5.75,-1.25; 23 5.75,-0.75; 24 5.75,-0.25; 25 5.75,0.25; 26 5.75,0.75; 27 5.75,1.25; 28 5.75,1.75; 29 5.75,2.25; 30 5.75,2.75; 31 5.75,3.25; 32 5.75,3.75; 49 -5.75,3.75; 50 -5.75,3.25; 51 -5.75,2.75; 52 -5.75,2.25; 53 -5.75,1.75; 54 -5.75,1.25; 55 -5.75,0.75; 56 -5.75,0.25; 57 -5.75,-0.25; 58 -5.75,-0.75; 59 -5.75,-1.25; 60 -5.75,-1.75; 61 -5.75,-2.25; 62 -5.75,-2.75; 63 -5.75,-3.25; 64 -5.75,-3.75
CRYSTAL-SMD-3.2X1.5MM = smd 1 x 1.8: P$1 -1.25,0; P$2 1.25,0
CRYSTAL-SMD-5X3.2-4PAD = smd 1.9 x 1.1: 1 -1.85,-1.15; 2 1.85,-1.15; 3 1.85,1.15; 4 -1.85,1.15

### Placement (x,y rotation side)
C1  16.64,7.24 270 top
C2  20.83,9.14 90 top
C3  23.24,16.81 0 top
C4  25.4,16.81 180 top
C5  48.64,4.83 0 top
C6  49.3,14.99 270 top
C8  33.78,5.97 270 top
C9  32.64,5.97 270 top
C10  36.07,5.97 270 top
C11  34.92,5.97 270 top
C12  48.64,5.84 0 top
C13  50.32,14.99 270 top
C14  38.1,18.92 90 top
C15  9.65,2.41 270 top
C16  31.49,15.88 180 top
C17  31.49,14.86 180 top
C18  31.49,13.84 180 top
C19  31.5,5.96 270 top
C20  51.31,14.99 270 top
D1  18.61,10.41 90 top
D2  17.02,10.41 90 top
D3  26.29,6.6 180 top
D4  26.29,8.18 0 top
D5  28.83,17.53 0 top
FD1  0.64,17.27 0 top
FD2  0.64,17.27 0 bottom
FD3  57.78,5.71 0 top
FD4  57.78,5.71 0 bottom
H1  2.54,2.54 0 top
H2  2.54,20.32 0 top
H3  55.88,20.32 0 top
H4  55.88,2.54 0 top
J1  6.35,11.43 270 top
J2  17.78,19.38 0 top
J3  9.4,17.78 180 top
J4  52.07,21.59 180 top
J5  52.07,1.27 180 top
J6  28.32,13.08 270 top
J7  38.35,16.89 90 bottom
LOGO1  9.4,16 0 top
LOGO2  18.29,11.43 90 bottom
LOGO3  3.81,11.43 90 bottom
PWR  27.94,5.84 270 bottom
R1  8.13,3.3 90 top
R2  6.6,3.3 90 top
R3  15.11,6.73 90 top
R4  29.08,6.6 0 top
R5  29.08,8.2 180 top
R6  24.26,11.81 180 top
R7  15.37,10.16 90 top
R8  10.54,4.19 0 top
R9  10.41,9.4 0 top
R10  10.41,10.92 0 top
R11  51.44,7.24 270 top
R12  28.83,18.8 0 top
S1  10.92,13.46 0 top
S2  10.92,6.86 0 top
TP1  31.75,15.24 0 bottom
TP2  31.75,12.7 0 bottom
U1  24.26,14.48 90 top
U2  19.43,6.73 270 top
U3  55.24,11.43 90 top
U4  41.91,11.43 270 top
U$1  [D53]  46.99,17.78 90 bottom
U$2  [#RST#0]  13.97,5.97 270 top
U$3  [BT00]  14.48,11.05 270 top
U$4  [D130]  31.75,19.18 270 top
U$5  [PWR0]  23.11,6.6 0 top
U$6  [CHG0]  23.11,8.18 0 top
U$7  [##RESET##0]  13.97,1.65 90 bottom
U$8  [#3V3#0]  16.51,1.65 90 bottom
U$9  [#NC#0]  19.05,1.65 90 bottom
U$10  [#GND#0]  21.59,1.65 90 bottom
U$11  [#A0#0]  24.13,1.65 90 bottom
U$12  [#A1#0]  26.67,1.65 90 bottom
U$13  [#A2#0]  29.21,1.65 90 bottom
U$14  [#A3#0]  31.75,1.65 90 bottom
U$15  [#A4#0]  34.29,1.65 90 bottom
U$16  [#A5#0]  36.83,1.65 90 bottom
U$23  [D62]  44.45,17.78 90 bottom
U$24  [D91]  41.91,17.78 90 bottom
U$25  [D100]  39.37,17.14 90 bottom
U$26  [SCL4]  49.53,16.89 90 bottom
U$27  [SDA5]  52.07,16.64 90 bottom
U$29  [#D11#0]  36.83,21.21 90 bottom
U$30  [#D12#0]  34.29,21.21 90 bottom
U$31  [#D13#0]  31.75,21.21 90 bottom
U$32  [#VUSB#0]  29.21,21.21 90 bottom
U$33  [#EN#0]  26.67,21.21 90 bottom
U$34  [#VBAT#0]  24.13,21.21 90 bottom
U$35  [3V30]  16.51,1.52 270 top
U$36  [NC0]  19.05,1.52 270 top
U$37  [GND0]  21.59,1.52 270 top
U$38  [A00]  24.13,1.65 270 top
U$39  [A10]  26.67,1.65 270 top
U$40  [A20]  29.21,1.65 270 top
U$41  [A30]  31.75,1.65 270 top
U$42  [A40]  34.29,1.65 270 top
U$43  [A50]  36.83,1.65 270 top
U$44  [SCK0]  39.37,1.91 270 top
U$45  [COPI0]  41.91,1.65 270 top
U$46  [CIPO0]  44.45,1.65 270 top
U$47  [D00]  46.99,1.65 270 top
U$48  [D10]  49.53,1.65 270 top
U$49  [BT00]  52.07,1.65 270 top
U$50  [VBAT_0]  24.13,21.21 270 top
U$51  [EN_0]  26.67,21.21 270 top
U$52  [D50]  46.99,21.21 270 top
U$53  [D60]  44.45,21.21 270 top
U$54  [D90]  41.91,21.21 270 top
U$55  [D100]  39.37,21.21 270 top
U$56  [D110]  36.83,21.21 270 top
U$57  [D120]  34.29,21.21 270 top
U$58  [PWR0]  27.94,7.49 0 bottom
U$59  [SCL_0]  49.53,21.21 270 top
U$60  [SDA_0]  52.07,21.21 270 top
U$61  [VUSB0]  29.21,19.81 180 top
U$62  [STM320]  10.92,11.43 90 bottom
U$63  [THING_PLUS0]  8,11.43 90 bottom
U$64  [STM32F405RG0]  35.94,11.43 90 bottom
U$65  [SFE_LOGO_FLAME_.1]  21.08,11.43 270 top
VB  34.54,15.24 0 bottom
Y1  33.78,15.49 270 top
Y2  33.02,10.29 270 top

### Tracks (layer width: path | path; a pad name or v marks a point on that pad's centre or on a via)
3.3V  (via drill 0.3)
  Top 0.203: C14.1 38.16,18.36 U4.64 38.16,16.25 39.45,14.96 39.45,14.86 | C9.1 C8.1 C11.1 C10.1 | U4.13 37,9.18 37.54,8.64 | U4.32 45.66,6.76 45.67,6.76 | U4.42 48.76,12.18 48.9,12.32 48.9,12.68 | 48.9,12.68 U4.43 | v50.72,12.78 48.99,12.78 48.9,12.68 | C13.1 50.32,15.98 50.16,16.13 48.77,16.13 48.59,15.95 48.59,15.57 48.2,15.18 U4.48 | U4.19 39.16,6.47 v39.32,6.63
  Top 0.406: v50.72,12.78 52.25,12.78 | 52.25,12.78 52.25,15.23 | 52.25,15.23 53.34,15.23 | 53.34,15.23 54.13,15.23 54.61,14.76 U3.7 | U3.8 53.34,15.23 | U3.3 55.88,7.62 55,6.74 R11.2 51.44,6.76 50.67,6.76 | C10.1 36.87,6.47 v36.91,6.5 37.54,7.14 37.54,8.64 37.72,8.64 39.45,10.36 39.45,14.86 | 50.67,6.76 48.14,6.76 | 48.14,6.76 45.67,6.76 39.45,6.76 v39.32,6.63 | C12.1 48.14,6.76 | R8.2 13.11,4.19 14.38,2.92 16.51,2.92 | 16.51,2.92 19.79,2.92 21.06,4.19 v22.84,4.19 22.84,6.38 21.53,7.68 U2.5 20.83,7.78 C2.1 | S1.3 v9.9,14.26 | v9.9,14.26 S1.4 | J3.2 v9.9,14.26 | J5.15 16.51,2.92 | 50.67,6.76 50.67,8.18 52.25,9.75 52.25,12.78 | C13.1 C20.1 51.99,15.49 52.25,15.23
  Bottom 0.203: PWR.2 27.94,4.19
  Bottom 0.406: v50.72,12.78 50.72,11.83 50.14,11.25 J7.VCC | J6.1 27,15.62 26.85,15.47 24.31,15.47 22.91,16.87 20.62,16.87 18.02,14.26 v9.9,14.26 9.37,14.26 8.71,13.61 8.71,6.93 10.01,5.64 21.39,5.64 v22.84,4.19 27.94,4.19 34.16,4.19 36.35,6.38 36.78,6.38 v36.91,6.5 39.19,6.5 v39.32,6.63
32KHZ_IN
  Top 0.203: U4.3 35.55,14.18 35.1,14.63 35.1,14.86 34.09,15.88 33.78,15.88 | 33.78,15.88 C16.1 | Y1.P$1 33.78,15.88
32KHZ_OUT
  Top 0.203: U4.4 35.34,13.68 34.78,14.24 Y1.P$2 33.78,14.61 32.75,14.61 32.5,14.86 C17.1
!RESET  (via drill 0.3)
  Top 0.203: S2.1 9.69,6.06 | 10.79,6.06 9.69,6.06 | v10.79,7.71 10.79,6.06 | 10.79,6.06 S2.2 | 9.69,6.06 R8.1 9.65,4.19 9.65,2.92 | C15.1 9.65,2.92 | J5.16 13.97,2.16 13.21,2.92 9.65,2.92 | U4.7 37,12.18 v37.24,12.42
  Bottom 0.203: v37.24,12.42 34.01,12.42 32.13,10.54 J6.10 28.96,10.41 28.19,9.65 26.16,9.65 25.53,10.29 15.21,10.29 13.74,11.76 11.07,11.76 10.79,11.48 v10.79,7.71
A0
  Top 0.203: U4.20 39.66,4.99 39.37,4.7 27.56,4.7 J5.12
A1
  Top 0.203: U4.21 40.16,4.73 39.7,4.27 29.67,4.27 J5.11
A2
  Top 0.203: U4.22 40.66,4.46 40.03,3.83 31.77,3.83 J5.10
A3
  Top 0.203: U4.23 41.16,4.2 40.36,3.4 33.88,3.4 J5.9
A4
  Top 0.203: U4.24 41.66,3.94 40.69,2.97 35.99,2.97 J5.8
A5
  Top 0.203: U4.25 42.16,3.55 41.15,2.54 38.1,2.54 J5.7
BOOT0  (via drill 0.3)
  Top 0.203: R7.2 15.37,12.32 15.02,12.66 S1.2 v10.03,12.66 S1.1 | U4.60 40.16,16.47 41.02,15.61 41.02,9.25 v40.77,8.99
  Bottom 0.203: J5.1 50.8,2.54 50.8,3.4 49.94,4.27 46,4.27 44.3,5.97 44.3,8.79 43.81,9.27 41.05,9.27 v40.77,8.99 40.72,8.99 39.57,7.85 11.91,7.85 11.05,6.99 10.29,6.99 10.03,7.24 v10.03,12.66
CIPO  (via drill 0.3)
  Top 0.203: v42.93,8.05 43.55,8.68 U4.35
  Bottom 0.203: J5.4 42.93,2.79 v42.93,8.05
COPI  (via drill 0.3)
  Top 0.203: U4.36 43.01,9.18 v41.91,8.08
  Bottom 0.203: J5.5 v41.91,8.08
D0/RX
  Top 0.203: J5.3 46.99,2.54 44.66,4.87 U4.30
D1/TX  (via drill 0.3)
  Top 0.203: U4.29 44.16,4.48 v45.72,2.92
  Bottom 0.203: v45.72,2.92 49.28,2.92 49.53,2.67 J5.2
D5  (via drill 0.3)
  Top 0.203: U4.38 44.94,10.18 44.4,10.72 44.4,12.72 46.86,15.19 46.86,15.7 47.17,16 v47.17,17.4
  Bottom 0.203: J4.3 47.17,21.41 v47.17,17.4
D6  (via drill 0.3)
  Top 0.203: U4.37 44.68,9.68 43.94,10.41 43.94,13 46.43,15.49 v46.43,17.45
  Bottom 0.203: v46.43,17.45 46.43,19.61 J4.4
D9
  Top 0.203: U4.61 39.66,17.82 39.88,18.03 39.88,19.56 J4.5
D10
  Top 0.203: U4.62 39.16,17.82 39.37,18.03 J4.6
D11
  Top 0.203: U4.11 38.07,10.18 38.93,11.04 38.93,14.92 36.96,16.89 36.96,21.46 J4.7
D12
  Top 0.203: U4.10 37.76,10.68 38.4,11.32 38.4,14.69 36.32,16.76 36.32,19.56 J4.8
D13
  Top 0.203: U4.9 37.47,11.18 37.8,11.51 37.8,14.66 35.69,16.76 35.69,18.8 34.29,20.19 32,20.19 31.87,20.32 | 31.87,20.32 31.75,20.44 J4.9 | R12.2 30.35,18.8 31.87,20.32
D+  (via drill 0.3)
  Top 0.203: R9.2 12.28,9.4 12.66,9.78 v13.34,9.78 | v44.91,11.25 45.03,11.25 46.14,12.35 46.14,12.92 46.9,13.68 U4.45
  Bottom 0.2: v44.91,11.25 44.86,11.3 37.13,11.3
  Bottom 0.203: 37.13,11.3 35.1,9.27 13.84,9.27 v13.34,9.78
D-  (via drill 0.3)
  Top 0.203: R10.2 12.6,10.92 v12.95,10.57 | U4.44 47.01,13.18 46.5,12.68 46.5,12.17 45.34,11 v45.34,10.75 | v12.95,10.57
  Bottom 0.2: v45.34,10.75 44.7,10.75 44.48,10.97 37.26,10.97
  Bottom 0.203: 37.26,10.97 35.25,8.97 13.26,8.97 12.72,9.5 12.72,10.34 v12.95,10.57
EN  (via drill 0.3)
  Top 0.203: U2.3 15.21,5.78 R3.1 15.11,4.55 v15.34,4.32
  Bottom 0.203: v15.34,4.32 15.27,4.24 5.79,4.24 3.43,6.6 3.43,16.38 5.71,18.67 5.71,20.57 6.35,21.21 9.91,21.21 10.79,20.32 25.4,20.32 J4.11
FLASH_!CS  (via drill 0.3)
  Top 0.203: U3.1 53.34,7.74 v53.31,7.74 R11.1 | U4.50 45.16,17.75 45.39,17.98 48.92,17.98 50.7,16.2 53.01,16.2 v53.34,15.88
  Bottom 0.203: v53.34,15.88 53.34,7.76 v53.31,7.74
FLASH_SCK
  Top 0.203: U3.6 55.88,14.78 54.05,16.61 51.08,16.61 49.2,18.49 43.41,18.49 42.66,17.74 U4.55
FLASH_SDI
  Top 0.203: U4.57 41.66,18.37 42.77,19.48 49.96,19.48 51.99,17.45 55.04,17.45 57.15,15.34 U3.5
FLASH_SDO  (via drill 0.3)
  Top 0.203: U4.56 42.16,18 43.16,19 49.58,19 51.56,17.02 54.56,17.02 v54.76,16.82 | U3.2 54.61,7.7 v54.69,7.62
  Bottom 0.203: v54.76,16.82 54.76,7.7 v54.69,7.62
GND  (via drill 0.3)
  Top 0.203: U2.2 C1.2 | U4.12 35.41,9.68 v34.92,10.16 | C14.2 38.11,19.43 38.85,19.43 38.85,18.13 38.66,17.94 U4.63 38.66,16.53 39.88,15.32 v40.28,15.32 | U4.28 43.66,3.41 v43.89,3.17 | U4.18 38.66,6.55 38.48,6.73
  other vias: 25.02,17.65 6.99,8.26 8,15.24 6.48,1.14 8.26,1.14 10.67,2.03 19.43,6.76 11.94,6.86 12.45,17.65 15.29,16.81 15.29,15.52 21.92,12.65 24.26,13.97 32.99,10.01 30.15,15.44 12.52,8.74 50.75,9.78 50.42,4.98 30.58,7.09 24.13,5.46 2.49,14.53 2.08,8.51 7.32,13 6.22,17.35 30.07,5.44 37.19,5.56 33.07,18.62 57.15,7.52 41.91,10.16 50.65,13.64
  pour Top (isolate 0.305, rank 2): 0,0 0,22.86 58.42,22.86 58.42,0
  pour Bottom (isolate 0.305, rank 2): 0,22.86 0,0 58.42,0 58.42,22.86
N$1
  Top 0.203: R12.1 27.95,18.42 D5.A
N$2  (via drill 0.3)
  Top 0.203: v30.48,6.22 30.1,6.6 R4.2
  Bottom 0.203: PWR.1 30.34,6.36 v30.48,6.22
N$3
  Top 0.203: R9.1 9.37,9.4 8.09,10.68 J1.B6 5.17,10.68 4.95,10.9 4.95,11.43 5.2,11.68 J1.A6
N$6
  Top 0.203: R10.1 8.53,10.92 8.28,11.18 7.11,11.18 | J1.A7 7.11,11.18 | J1.B7 6.87,12.18 7.11,11.94 7.11,11.18
N$7
  Top 0.203: R4.1 D3.A
N$8
  Top 0.203: U1.5 22.96,13.02 23.41,12.57 R6.2
N$9
  Top 0.254: R2.2 6.6,5.33 6.22,5.71 3.94,5.71 3.05,6.6 3.05,11.43 4.3,12.68 J1.A5
N$10
  Top 0.254: J1.B5 7.21,9.68 7.87,9.02 7.87,5.17 8.13,4.91 R1.2
N$14
  Top 0.254: R5.2 28.56,8.18 D4.C
N$15
  Top 0.203: U1.1 26.35,13.53 26.54,13.34 26.54,9.78 27.2,9.12 29.23,9.12 29.58,8.77 R5.1
N$16
  Top 0.203: C5.1 45.47,4.83 45.16,5.13 U4.31
N$18
  Top 0.203: C6.1 48.49,14.68 U4.47
OSC_IN
  Top 0.203: U4.5 35.28,13.18 35,13.46 33.4,13.46 33.02,13.08 33.02,12.32 32.84,12.14 Y2.1 31.99,12.26 C18.1
OSC_OUT
  Top 0.203: C19.1 31.5,6.99 31.62,7.11 34.04,7.11 34.17,7.25 Y2.3 34.17,10.29 35.18,11.3 35.18,12.32 35.54,12.68 U4.6
SCK  (via drill 0.3)
  Top 0.203: v41.15,7.57 41.27,7.44 43.26,7.44 43.99,8.18 U4.34
  Bottom 0.203: J5.6 39.37,2.13 41.15,3.91 v41.15,7.57
SCL  (via drill 0.3)
  Top 0.203: U4.58 41.16,18.93 42.42,20.19 v43.18,20.19 48.13,20.19 J4.2 | J3.4 7.9,19.45 v8,19.56
  Bottom 0.203: v8,19.56 9.4,19.56 9.96,19 27.82,19 29.01,20.19 v43.18,20.19
SDA  (via drill 0.3)
  Top 0.203: v40.64,19.51 40.66,19.49 U4.59 | v8.89,19.05 J3.3
  Bottom 0.203: J4.1 52.07,20.45 51.44,19.81 48.79,19.81 47.88,18.9 47.88,17.27 47.46,16.85 46.14,16.85 45.78,17.21 45.78,18.91 45.19,19.51 v40.64,19.51 29.29,19.51 28.19,18.41 9.53,18.41 v8.89,19.05
SDIO_CLK  (via drill 0.3)
  Top 0.203: v43.39,15.36 43.66,15.63 U4.53
  Bottom 0.203: J7.SCLK 48.1,12.35 47.49,12.96 47.49,13.64 45.78,15.36 v43.39,15.36
SDIO_CMD  (via drill 0.3)
  Top 0.203: v42.77,14.73 42.77,15.77 43.16,16.16 U4.54
  Bottom 0.203: J7.DI/CMD 48.14,10.15 47.06,11.23 47.06,13.39 45.72,14.73 v42.77,14.73
SDIO_D0  (via drill 0.3)
  Top 0.203: v50.42,10.67 v50.42,10.68 U4.39
  Bottom 0.203: v50.42,10.67 51.44,11.68 51.44,14.1 50.98,14.55 J7.DO/DAT0
SDIO_D1  (via drill 0.3)
  Top 0.203: v51.38,10.74 50.95,11.18 U4.40
  Bottom 0.2: J7.DAT1 50.64,15.65 51.92,14.38 51.92,11.28
  Bottom 0.203: 51.92,11.28 v51.38,10.74
SDIO_D2  (via drill 0.3)
  Top 0.203: v43.08,13.39 43.08,13.56 44.66,15.14 U4.51
  Bottom 0.203: J7.DAT2 46.96,7.95 46,8.92 46,12.8 45.41,13.39 v43.08,13.39
SDIO_D3  (via drill 0.3)
  Top 0.203: v42.42,13.92 42.86,13.92 44.16,15.22 U4.52
  Bottom 0.203: J7.CS/DAT3 47.72,9.05 46.5,10.27 46.5,13.19 45.77,13.92 v42.42,13.92
SWCLK  (via drill 0.3)
  Top 0.203: U4.49 45.66,15.48 43.61,13.44 43.61,12.27 v43.36,12.01
  Bottom 0.203: v43.36,12.01 38.73,12.01 37.08,13.66 31.75,13.66 | 31.75,13.66 29.64,13.66 J6.4 | TP2.P$1 31.75,13.66
SWDIO  (via drill 0.3)
  Top 0.203: U4.46 46.64,14.18 v44.96,12.5
  Bottom 0.203: v44.96,12.5 38.86,12.5 37.24,14.12 31.75,14.12 | 31.75,14.12 30.45,14.12 J6.2 | TP1.P$1 31.75,14.12
V_BATT  (via drill 0.3)
  Top 0.406: C4.1 25.93,16.79 v25.93,16.1 25.93,17.89 24.13,19.68 J4.12 | U1.3 24.57,15.43 23.62,14.48 21.21,14.48 20.83,14.1 20.83,13.21 20.19,12.57 18.8,12.57 | 18.8,12.57 18.61,12.38 D1.A | J2.2 18.8,15.68 18.8,12.57
  pour Top (isolate 0.305, no thermals): 26.24,17.14 26.24,15.24 25.02,15.24 25.02,15.62 25.53,16.13 25.53,17.14
V_USB  (via drill 0.3)
  Top 0.203: D2.A 17.02,11.05 17.65,10.41 22.35,10.41 23.11,9.65 23.11,8.51 23.44,8.18 D4.A
  Top 0.406: J1.VBUS2 5.37,8.98 v4.83,9.53 | J1.VBUS1 5.36,13.88 v4.83,13.35 v4.83,13.34 | C3.1 22.74,15.49 v21.72,15.49 22.73,15.49 v22.73,19.71 | D2.A v17.02,12.57
  Bottom 0.406: v4.83,9.53 v4.83,13.34 6.1,13.34 7.11,14.35 7.11,19.81 7.64,20.34 9.65,20.34 10.29,19.71 v22.73,19.71 27.33,19.71 J4.10 | v21.72,15.49 18.8,12.57 v17.02,12.57
  pour Top (isolate 0.305, no thermals): 22.35,17.17 22.35,15.24 23.5,15.24 23.5,15.62 23.09,16.23 23.09,17.17
VB  (via drill 0.3)
  Top 0.203: U4.1 35.49,15.18 35.18,15.49 v35.18,15.88
  Bottom 0.203: VB.P$1 v35.18,15.88
VIN
  Top 0.406: U2.1 16.7,7.68 C1.1 | R3.2 15.27,7.74 C1.1 | D2.C 17.02,8.63 16.64,8.25 C1.1
  Top 0.61: D2.C D1.C

### Text on the board
Bottom: v10